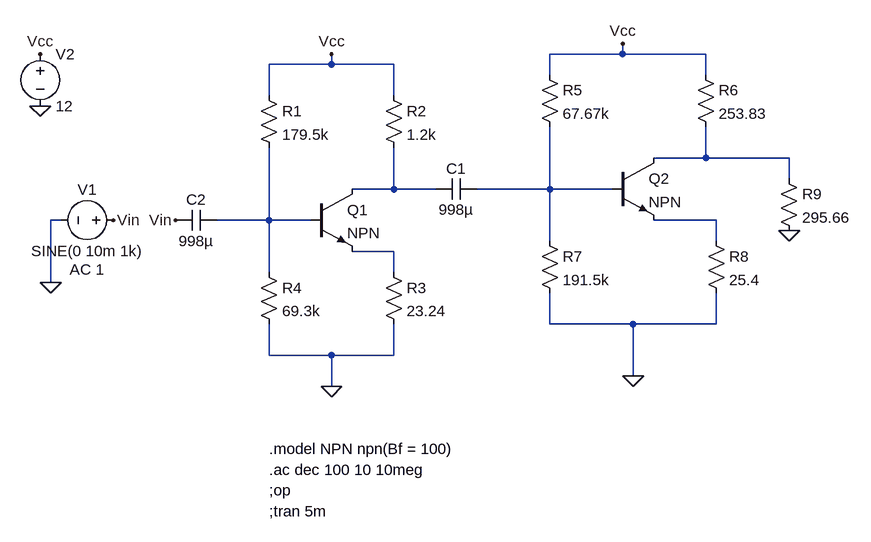
[diagram p0: schematic estagio2.asc]
estagio2.asc, the LTspice schematic file:
Version 4
SHEET 1 984 816
WIRE 608 96 608 80
WIRE 608 96 496 96
WIRE 736 96 608 96
WIRE 160 112 160 96
WIRE 160 112 64 112
WIRE 256 112 160 112
WIRE 496 128 496 96
WIRE 736 128 736 96
WIRE 64 160 64 112
WIRE 256 160 256 112
WIRE 736 256 736 208
WIRE 736 256 656 256
WIRE 864 256 736 256
WIRE 864 288 864 256
WIRE 256 304 256 240
WIRE 256 304 192 304
WIRE 320 304 256 304
WIRE 496 304 496 208
WIRE 496 304 384 304
WIRE 592 304 496 304
WIRE -256 352 -272 352
WIRE 64 352 64 240
WIRE 64 352 -16 352
WIRE 128 352 64 352
WIRE 752 352 656 352
WIRE 496 384 496 304
WIRE 752 384 752 352
WIRE 256 400 192 400
WIRE 64 432 64 352
WIRE 256 432 256 400
WIRE -272 448 -272 352
WIRE 496 512 496 464
WIRE 624 512 496 512
WIRE 752 512 752 464
WIRE 752 512 624 512
WIRE 64 560 64 512
WIRE 160 560 64 560
WIRE 256 560 256 512
WIRE 256 560 160 560
WIRE 624 592 624 512
WIRE 160 608 160 560
FLAG 160 96 Vcc
FLAG 160 608 0
FLAG -272 448 0
FLAG -288 176 0
FLAG -288 96 Vcc
FLAG -176 352 Vin
FLAG -80 352 Vin
FLAG 608 80 Vcc
FLAG 624 592 0
FLAG 864 368 0
SYMBOL res 48 144 R0
SYMATTR InstName R1
SYMATTR Value 179.5k
SYMBOL res 240 144 R0
SYMATTR InstName R2
SYMATTR Value 1.2k
SYMBOL res 240 416 R0
SYMATTR InstName R3
SYMATTR Value 23.24
SYMBOL res 48 416 R0
SYMATTR InstName R4
SYMATTR Value 69.3k
SYMBOL npn 128 304 R0
SYMATTR InstName Q1
SYMBOL cap 384 288 R90
WINDOW 0 0 32 VBottom 2
WINDOW 3 32 32 VTop 2
SYMATTR InstName C1
SYMATTR Value 998µ
SYMBOL cap -16 336 R90
WINDOW 0 0 32 VBottom 2
WINDOW 3 32 32 VTop 2
SYMATTR InstName C2
SYMATTR Value 998µ
SYMBOL voltage -160 352 R90
WINDOW 0 -32 56 VBottom 2
WINDOW 3 32 56 VTop 2
WINDOW 123 60 56 VTop 2
WINDOW 39 0 0 Left 0
SYMATTR InstName V1
SYMATTR Value SINE(0 10m 1k)
SYMATTR Value2 AC 1
SYMBOL voltage -288 80 R0
WINDOW 123 0 0 Left 0
WINDOW 39 0 0 Left 0
SYMATTR InstName V2
SYMATTR Value 12
SYMBOL res 480 112 R0
SYMATTR InstName R5
SYMATTR Value 67.67k
SYMBOL res 720 112 R0
SYMATTR InstName R6
SYMATTR Value 253.83
SYMBOL res 480 368 R0
SYMATTR InstName R7
SYMATTR Value 191.5k
SYMBOL res 736 368 R0
SYMATTR InstName R8
SYMATTR Value 25.4
SYMBOL npn 592 256 R0
SYMATTR InstName Q2
SYMBOL res 848 272 R0
SYMATTR InstName R9
SYMATTR Value 295.66
TEXT 64 704 Left 2 !.model NPN npn(Bf = 100)
TEXT 64 736 Left 2 !.ac dec 100 10 10meg
TEXT 64 768 Left 2 !;op
TEXT 64 800 Left 2 !;tran 5m

The netlist it stands for:
* estagio2.asc
R1 Vcc N004 179.5k
R2 Vcc N002 1.2k
R3 N006 0 23.24
R4 N004 0 69.3k
Q1 N002 N004 N006 0 NPN
C1 N003 N002 998µ
C2 N004 Vin 998µ
V1 Vin 0 SINE(0 10m 1k) AC 1
V2 Vcc 0 12
R5 Vcc N003 67.67k
R6 Vcc N001 253.83
R7 N003 0 191.5k
R8 N005 0 25.4
Q2 N001 N003 N005 0 NPN
R9 N001 0 295.66
.model NPN NPN
.model PNP PNP
.lib standard.bjt
.model NPN npn(Bf = 100)
.ac dec 100 10 10meg
;op
;tran 5m
.backanno
.end